# Altium project Navi.VIP.PrjPcb
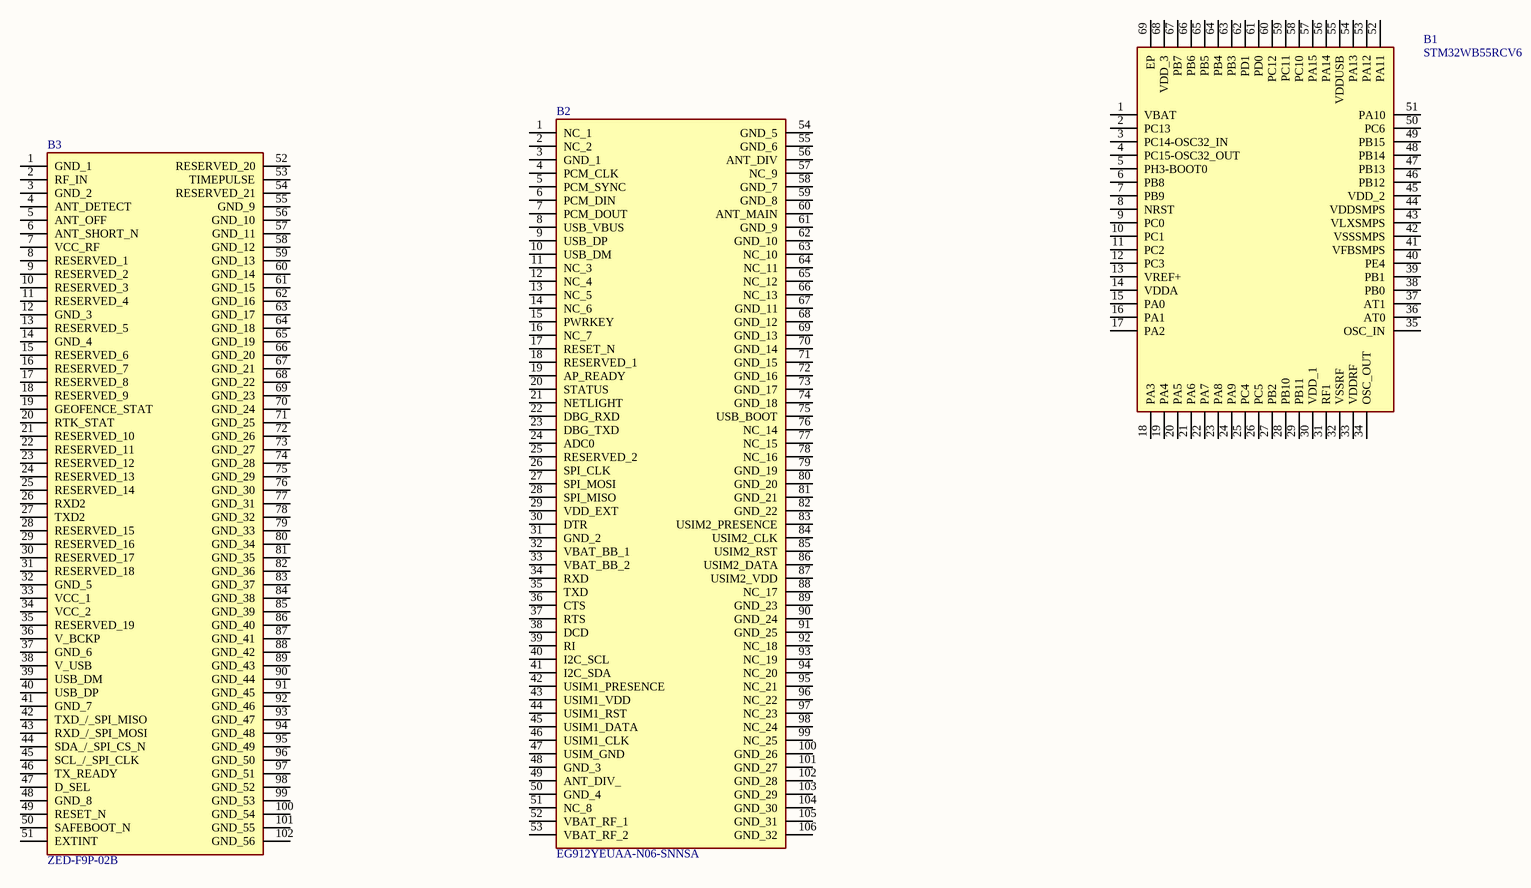
[diagram p0: Sheet1.SchDoc]
1 sheet, 3 parts. Net scope: global (net labels, ports and power ports of the same name join across sheets).
Board file: PCB1.PcbDoc

## Sheet Sheet1.SchDoc
size E; SheetNumber: 1; SheetTotal: 1

### Parts
B1  STM32WB55RCV6  [QFN40P800X800X100-69N-D]
B2  EG912YEUAA-N06-SNNSA  [EG912YEUAAN06SNNSA]
B3  ZED-F9P-02B  [ZEDF9P02B]

### Nets

Not connected (* = marked no-connect by the designer): B1 1(VBAT) 2(PC13) 3(PC14-OSC32_IN) 4(PC15-OSC32_OUT) 5(PH3-BOOT0) 6(PB8) 7(PB9) 8(NRST) 9(PC0) 10(PC1) 11(PC2) 12(PC3) 13(VREF+) 14(VDDA) 15(PA0) 16(PA1) 17(PA2) 18(PA3) 19(PA4) 20(PA5) 21(PA6) 22(PA7) 23(PA8) 24(PA9) 25(PC4) 26(PC5) 27(PB2) 28(PB10) 29(PB11) 30(VDD_1) 31(RF1) 32(VSSRF) 33(VDDRF) 34(OSC_OUT) 35(OSC_IN) 36(AT0) 37(AT1) 38(PB0) 39(PB1) 40(PE4) 41(VFBSMPS) 42(VSSSMPS) 43(VLXSMPS) 44(VDDSMPS) 45(VDD_2) 46(PB12) 47(PB13) 48(PB14) 49(PB15) 50(PC6) 51(PA10) 52(PA11) 53(PA12) 54(PA13) 55(VDDUSB) 56(PA14) 57(PA15) 58(PC10) 59(PC11) 60(PC12) 61(PD0) 62(PD1) 63(PB3) 64(PB4) 65(PB5) 66(PB6) 67(PB7) 68(VDD_3) 69(EP); B2 1(NC_1) 2(NC_2) 3(GND_1) 4(PCM_CLK) 5(PCM_SYNC) 6(PCM_DIN) 7(PCM_DOUT) 8(USB_VBUS) 9(USB_DP) 10(USB_DM) 11(NC_3) 12(NC_4) 13(NC_5) 14(NC_6) 15(PWRKEY) 16(NC_7) 17(RESET_N) 18(RESERVED_1) 19(AP_READY) 20(STATUS) 21(NETLIGHT) 22(DBG_RXD) 23(DBG_TXD) 24(ADC0) 25(RESERVED_2) 26(SPI_CLK) 27(SPI_MOSI) 28(SPI_MISO) 29(VDD_EXT) 30(DTR) 31(GND_2) 32(VBAT_BB_1) 33(VBAT_BB_2) 34(RXD) 35(TXD) 36(CTS) 37(RTS) 38(DCD) 39(RI) 40(I2C_SCL) 41(I2C_SDA) 42(USIM1_PRESENCE) 43(USIM1_VDD) 44(USIM1_RST) 45(USIM1_DATA) 46(USIM1_CLK) 47(USIM_GND) 48(GND_3) 49(ANT_DIV_) 50(GND_4) 51(NC_8) 52(VBAT_RF_1) 53(VBAT_RF_2) 54(GND_5) 55(GND_6) 56(ANT_DIV) 57(NC_9) 58(GND_7) 59(GND_8) 60(ANT_MAIN) 61(GND_9) 62(GND_10) 63(NC_10) 64(NC_11) 65(NC_12) 66(NC_13) 67(GND_11) 68(GND_12) 69(GND_13) 70(GND_14) 71(GND_15) 72(GND_16) 73(GND_17) 74(GND_18) 75(USB_BOOT) 76(NC_14) 77(NC_15) 78(NC_16) 79(GND_19) 80(GND_20) 81(GND_21) 82(GND_22) 83(USIM2_PRESENCE) 84(USIM2_CLK) 85(USIM2_RST) 86(USIM2_DATA) 87(USIM2_VDD) 88(NC_17) 89(GND_23) 90(GND_24) 91(GND_25) 92(NC_18) 93(NC_19) 94(NC_20) 95(NC_21) 96(NC_22) 97(NC_23) 98(NC_24) 99(NC_25) 100(GND_26) 101(GND_27) 102(GND_28) 103(GND_29) 104(GND_30) 105(GND_31) 106(GND_32); B3 1(GND_1) 2(RF_IN) 3(GND_2) 4(ANT_DETECT) 5(ANT_OFF) 6(ANT_SHORT_N) 7(VCC_RF) 8(RESERVED_1) 9(RESERVED_2) 10(RESERVED_3) 11(RESERVED_4) 12(GND_3) 13(RESERVED_5) 14(GND_4) 15(RESERVED_6) 16(RESERVED_7) 17(RESERVED_8) 18(RESERVED_9) 19(GEOFENCE_STAT) 20(RTK_STAT) 21(RESERVED_10) 22(RESERVED_11) 23(RESERVED_12) 24(RESERVED_13) 25(RESERVED_14) 26(RXD2) 27(TXD2) 28(RESERVED_15) 29(RESERVED_16) 30(RESERVED_17) 31(RESERVED_18) 32(GND_5) 33(VCC_1) 34(VCC_2) 35(RESERVED_19) 36(V_BCKP) 37(GND_6) 38(V_USB) 39(USB_DM) 40(USB_DP) 41(GND_7) 42(TXD_/_SPI_MISO) 43(RXD_/_SPI_MOSI) 44(SDA_/_SPI_CS_N) 45(SCL_/_SPI_CLK) 46(TX_READY) 47(D_SEL) 48(GND_8) 49(RESET_N) 50(SAFEBOOT_N) 51(EXTINT) 52(RESERVED_20) 53(TIMEPULSE) 54(RESERVED_21) 55(GND_9) 56(GND_10) 57(GND_11) 58(GND_12) 59(GND_13) 60(GND_14) 61(GND_15) 62(GND_16) 63(GND_17) 64(GND_18) 65(GND_19) 66(GND_20) 67(GND_21) 68(GND_22) 69(GND_23) 70(GND_24) 71(GND_25) 72(GND_26) 73(GND_27) 74(GND_28) 75(GND_29) 76(GND_30) 77(GND_31) 78(GND_32) 79(GND_33) 80(GND_34) 81(GND_35) 82(GND_36) 83(GND_37) 84(GND_38) 85(GND_39) 86(GND_40) 87(GND_41) 88(GND_42) 89(GND_43) 90(GND_44) 91(GND_45) 92(GND_46) 93(GND_47) 94(GND_48) 95(GND_49) 96(GND_50) 97(GND_51) 98(GND_52) 99(GND_53) 100(GND_54) 101(GND_55) 102(GND_56)

### Library data of the parts
B1 = STM32WB55RCV6: Bluetooth v5.0 and 802.15.4 With Microcontroller Combo module; Manufacturer_Name: STMicroelectronics; Geometry.Height: 1mm; Manufacturer_Part_Number: STM32WB55RCV6; Mouser Part Number: 511-STM32WB55RCV6; Mouser Price/Stock: https://www.mouser.co.uk/ProductDetail/STMicroelectronics/STM32WB55RCV6?qs=vLWxofP3U2y%2F21YKkPUpfQ%3D%3D; Arrow Part Number: STM32WB55RCV6; Arrow Price/Stock: https://www.arrow.com/en/products/stm32wb55rcv6/stmicroelectronics?region=nac; Datasheet Link: https://www.mouser.com/datasheet/2/389/stm32wb55rc-1588898.pdf
B2 = EG912YEUAA-N06-SNNSA: DESCRIPTION PLACE HOLDER; Manufacturer_Name: Quectel; Geometry.Height: 2.5mm; Manufacturer_Part_Number: EG912YEUAA-N06-SNNSA; Mouser Part Number: 277-EG912YEUAN6SNNSA; Mouser Price/Stock: https://www.mouser.co.uk/ProductDetail/Quectel/EG912YEUAA-N06-SNNSA?qs=zW32dvEIR3tlKTTxnXn4Aw%3D%3D; Arrow Part Number: EG912YEUAA-N06-SNNSA; Arrow Price/Stock: https://www.arrow.com/en/products/eg912yeuaa-n06-snnsa/quectel-wireless-solutions-co-ltd?region=nac; Datasheet Link: *
B3 = ZED-F9P-02B: MOD RF RECEIVER GNSS 54LGA; Manufacturer_Name: U-Blox; Geometry.Height: 2.6mm; Manufacturer_Part_Number: ZED-F9P-02B; Mouser Part Number: 377-ZED-F9P-02B; Mouser Price/Stock: https://www.mouser.co.uk/ProductDetail/u-blox/ZED-F9P-02B?qs=DPoM0jnrROVJit2O2Grdqw%3D%3D; Arrow Part Number: *; Arrow Price/Stock: *; Datasheet Link: https://www.u-blox.com/sites/default/files/ZED-F9P_DataSheet_%28UBX-17051259%29.pdf